# Altium schematic sheet CANDataDiodeSchematic-STM32F0-Rev7.SchDoc: CAN Data Diode STM32F0
size Legal; DrawnBy: Jeremy Daily; Revision: 1
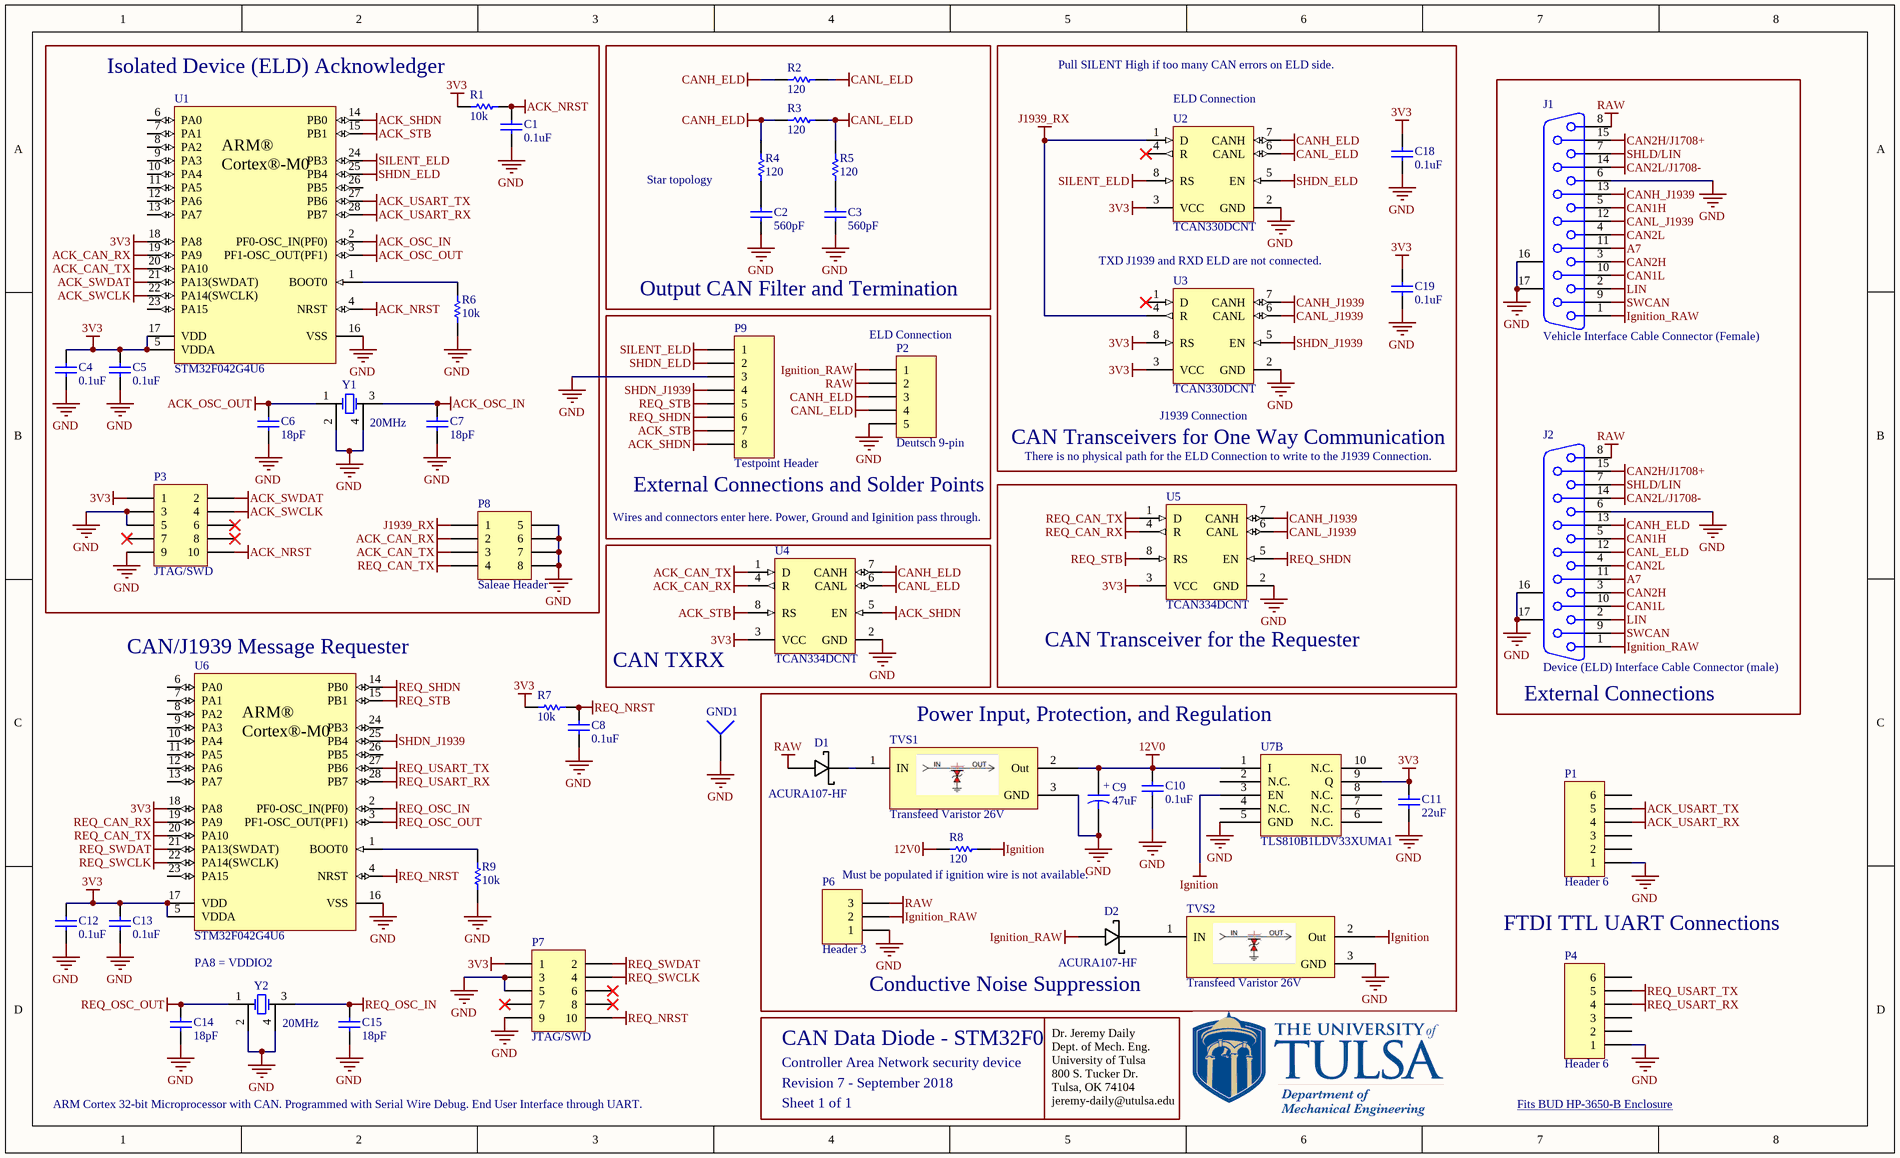
[diagram p0: CANDataDiodeSchematic-STM32F0-Rev7.SchDoc]

## Parts
C1  0.1uF  [0402]
C2  560pF  [0402]
C3  560pF  [0402]
C4  0.1uF  [0402]
C5  0.1uF  [0402]
C6  18pF  [0402]
C7  18pF  [0402]
C8  0.1uF  [0402]
C9  47uF  [Elec. Cap - D]
C10  0.1uF  [0402]
C11  22uF  [1206]
C12  0.1uF  [0402]
C13  0.1uF  [0402]
C14  18pF  [0402]
C15  18pF  [0402]
C18  0.1uF  [0402]
C19  0.1uF  [0402]
D1  ACURA107-HF  [SMA with A and K]
D2  ACURA107-HF  [SMA with A and K]
GND1  Socket  [PIN1]  (value not drawn)
J1  Vehicle Interface Cable Connector (Female)  [DSUB1.385-2H15]
J2  Device (ELD) Interface Cable Connector (male)  [DSUB1.385-2H15]
P1  Header 6  [HDR1X6]
P2  Deutsch 9-pin  [HDR1X5]
P3  JTAG/SWD  [MHDR2X5]
P4  Header 6  [HDR1X6]
P6  Header 3  [HDR1X3]
P7  JTAG/SWD  [MHDR2X5]
P8  Saleae Header  [HDR2X4_CEN]
P9  Testpoint Header  [HDR1X8]
R1  10k  [0402]
R2  120  [0402]
R3  120  [0402]
R4  120  [0402]
R5  120  [0402]
R6  10k  [0402]
R7  10k  [0402]
R8  120  [0402]
R9  10k  [0402]
TVS1  Transfeed Varistor 26V  [Transfeed]
TVS2  Transfeed Varistor 26V  [Transfeed]
U1  STM32F042G4U6  [STM-UFQFPN28_V]
U2  TCAN330DCNT  [SOT65P280X145-8N]
U3  TCAN330DCNT  [SOT65P280X145-8N]
U4  TCAN334DCNT  [SOT65P280X145-8N]
U5  TCAN334DCNT  [SOT65P280X145-8N]
U6  STM32F042G4U6  [STM-UFQFPN28_V]
U7  TLS810B1LDV33XUMA1  [SON50P330X110_HS-11N]  (part B of 2)
Y1  20MHz  [XTAL 4 pad]
Y2  20MHz  [XTAL 4 pad]

## Blocks framed on the sheet
Isolated Device (ELD) Acknowledger: C1 C4-C7 P3 P8 R1 R6 U1 Y1
Output CAN Filter and Termination: C2 C3 R2-R5
CAN Transceivers for One Way Communication: C18 C19 U2 U3
External Connections: J1 J2
CAN Transceiver for the Requester: U5
CAN TXRX: U4

## Nets
3V3: C4.2 C5.2 C11.2 C12.2 C13.2 C18.2 C19.2 P3.1 P7.1 R1.2 R7.2 U1.5(VDDA) U1.17(VDD) U1.18(PA8) U2.3(VCC) U3.3(VCC) U3.8(RS) U4.3(VCC) U5.3(VCC) U6.5(VDDA) U6.17(VDD) U6.18(PA8) U7.9(Q)
12V0: C9.1 C10.2 R8.1 TVS1.2(Out) U7.1(I)
A7: J1.11 J2.11
ACK_CAN_RX: P8.2 U1.19(PA9) U4.4(R)
ACK_CAN_TX: P8.3 U1.20(PA10) U4.1(D)
ACK_NRST: C1.2 P3.10 R1.1 U1.4(NRST)
ACK_OSC_IN: C7.1 U1.2(PF0-OSC_IN(PF0)) Y1.3(OSC2)
ACK_OSC_OUT: C6.2 U1.3(PF1-OSC_OUT(PF1)) Y1.1(OSC1)
ACK_SHDN: P9.8 U1.14(PB0) U4.5(EN)
ACK_STB: P9.7 U1.15(PB1) U4.8(RS)
ACK_SWCLK: P3.4 U1.22(PA14(SWCLK))
ACK_SWDAT: P3.2 U1.21(PA13(SWDAT))
ACK_USART_RX: P1.4 U1.28(PB7)
ACK_USART_TX: P1.5 U1.27(PB6)
CAN1H: J1.5 J2.5
CAN1L: J1.10 J2.10
CAN2H: J1.3 J2.3
CAN2H/J1708+: J1.15 J2.15
CAN2L: J1.4 J2.4
CAN2L/J1708-: J1.14 J2.14
CANH_ELD: J2.13 P2.3 R2.2 R3.2 R4.1 U2.7(CANH) U4.7(CANH)
CANH_J1939: J1.13 U3.7(CANH) U5.7(CANH)
CANL_ELD: J2.12 P2.4 R2.1 R3.1 R5.1 U2.6(CANL) U4.6(CANL)
CANL_J1939: J1.12 U3.6(CANL) U5.6(CANL)
GND: C1.1 C2.1 C3.1 C4.1 C5.1 C6.1 C7.2 C8.1 C9.2(-) C10.1 C11.1 C12.1 C13.1 C14.1 C15.2 C18.1 C19.1 GND1.1 J1.6 J1.16(MH1) J1.17(MH2) J2.6 J2.16(MH1) J2.17(MH2) P1.1 P2.5 P3.3 P3.5 P3.9 P4.1 P6.1 P7.3 P7.5 P7.9 P8.5 P8.6 P8.7 P8.8 P9.3 R6.1 R9.1 TVS1.3(GND) TVS2.3(GND) U1.16(VSS) U2.2(GND) U3.2(GND) U4.2(GND) U5.2(GND) U6.16(VSS) U7.5(GND) Y1.2(OSC2) Y1.4(GND) Y2.2(OSC2) Y2.4(GND)
Ignition: R8.2 TVS2.2(Out) U7.3(EN)
Ignition_RAW: D2.1(A) J1.1 J2.1 P2.1 P6.2
J1939_RX: P8.1 U2.1(D) U3.4(R)
LIN: J1.2 J2.2
RAW: D1.1(A) J1.8 J2.8 P2.2 P6.3
REQ_CAN_RX: U5.4(R) U6.19(PA9)
REQ_CAN_TX: P8.4 U5.1(D) U6.20(PA10)
REQ_NRST: C8.2 P7.10 R7.1 U6.4(NRST)
REQ_OSC_IN: C15.1 U6.2(PF0-OSC_IN(PF0)) Y2.3(OSC2)
REQ_OSC_OUT: C14.2 U6.3(PF1-OSC_OUT(PF1)) Y2.1(OSC1)
REQ_SHDN: P9.6 U5.5(EN) U6.14(PB0)
REQ_STB: P9.5 U5.8(RS) U6.15(PB1)
REQ_SWCLK: P7.4 U6.22(PA14(SWCLK))
REQ_SWDAT: P7.2 U6.21(PA13(SWDAT))
REQ_USART_RX: P4.4 U6.28(PB7)
REQ_USART_TX: P4.5 U6.27(PB6)
SHDN_ELD: P9.2 U1.25(PB4) U2.5(EN)
SHDN_J1939: P9.4 U3.5(EN) U6.25(PB4)
SHLD/LIN: J1.7 J2.7
SILENT_ELD: P9.1 U1.24(PB3) U2.8(RS)
SWCAN: J1.9 J2.9
NetC2_2: C2.2 R4.2
NetC3_2: C3.2 R5.2
NetD1_2: D1.2(K) TVS1.1(IN)
NetD2_2: D2.2(K) TVS2.1(IN)
NetR6_2: R6.2 U1.1(BOOT0)
NetR9_2: R9.2 U6.1(BOOT0)

Not connected (* = marked no-connect by the designer): P1 2 3 6; P3 6* 7* 8*; P4 2 3 6; P7 6* 7* 8*; U1 6(PA0) 7(PA1) 8(PA2) 9(PA3) 10(PA4) 11(PA5) 12(PA6) 13(PA7) 23(PA15) 26(PB5); U2 4(R)*; U3 1(D)*; U6 6(PA0) 7(PA1) 8(PA2) 9(PA3) 10(PA4) 11(PA5) 12(PA6) 13(PA7) 23(PA15) 24(PB3) 26(PB5); U7 2(N.C.) 4(N.C.) 6(N.C.) 7(N.C.) 8(N.C.) 10(N.C.)

## Notes on the sheet
- Pull SILENT High if too many CAN errors on ELD side.
- (near U2) ELD Connection
- (near U1) ARM®
  Cortex®-M0
- Star topology
- TXD J1939 and RXD ELD are not connected.
- (near P2) ELD Connection
- (near U3) J1939 Connection
- (near P9) External Connections and Solder Points
- (near J2) There is no physical path for the ELD Connection to write to the J1939 Connection.
- Wires and connectors enter here. Power, Ground and Iginition pass through.
- (near U6) CAN/J1939 Message Requester
- (near U6) ARM®
  Cortex®-M0
- Power Input, Protection, and Regulation
- Must be populated if ignition wire is not available.
- PA8 = VDDIO2
- FTDI TTL UART Connections
- CAN Data Diode - STM32F0
- (near TVS2) Conductive Noise Suppression
- ARM Cortex 32-bit Microprocessor with CAN. Programmed with Serial Wire Debug. End User Interface through UART.
- Controller Area Network security device
- Revision 7 - September 2018
- Sheet 1 of 1
- Fits BUD HP-3650-B Enclosure <https://www.budind.com/pdf/hb3650.pdf>
- Dr. Jeremy Daily
  Dept. of Mech. Eng.
  University of Tulsa
  800 S. Tucker Dr.
  Tulsa, OK 74104
  jeremy-daily@utulsa.edu
- (in symbol Electrolytic Cap) +

## Library data of the parts
C1 C4 C5 C8 C10 C12 C13 C18 C19 = Cap: 0.1µF ±10% 50V Ceramic Capacitor X7R 0402 (1005 Metric); Manufacturer: TDK Corporation; PartNumber: CGA2B3X7R1H104K050BB; Alternative: Acceptable; Supplier 1: Digi-Key; Supplier Part Number 1: 445-6899-1-ND
C2 C3 = Cap: 560pF ±5% 50V Ceramic Capacitor CH 0402 (1005 Metric); Manufacturer: Taiyo Yuden; PartNumber: 06031C561K4T2A; Alternative: Acceptable; Supplier 1: Digi-Key; Supplier Part Number 1: 587-5093-1-ND
C6 C7 C14 C15 = Cap: 18pF ±5% 50V Ceramic Capacitor C0G, NP0 0402 (1005 Metric); Manufacturer: Murata Electronics North America; PartNumber: GCM1555C1H180JA16D; Alternative: Acceptable; Supplier 1: Digi-Key; Supplier Part Number 1: 490-12650-1-ND
C9 = Electrolytic Cap: 47µF 35V Aluminum Capacitors Radial, Can - SMD 5000 Hrs @ 105°C; Manufacturer: Panasonic Electronic Components; PartNumber: EEE-HDV470XAP; Alternative: Acceptable; Supplier 1: Digi-Key; Supplier Part Number 1: PCE4968CT-ND
C11 = Cap: 22µF ±20% 4V Ceramic Capacitor X7R 1206 (3216 Metric); Manufacturer: Taiyo Yuden; PartNumber: AMK316AB7226MLHT; Alternative: Acceptable; Supplier 1: Digi-Key; Supplier Part Number 1: 587-3267-1-ND
D1 D2 = Schottky Diode: Diode Schottky 1000V 1A Surface Mount DO-214AC (SMA); Manufacturer: Comchip Technology; Alternative: None; Supplier 1: Digi-Key; Supplier Part Number 1: 641-1884-1-ND; PartNumber: ACURA107-HF
GND1 = Socket: Alternative: None
J1 = D Connector 15: Receptacle Assembly, 15 Position, Right Angle; Manufacturer: Amphenol FCI; PartNumber: D15S33E4GV00LF; Alternative: Acceptable; Supplier 1: Digi-Key; Supplier Part Number 1: 609-1498-ND
J2 = D Connector 15: Receptacle Assembly, 15 Position, Right Angle; Manufacturer: Amphenol FCI; PartNumber: D15P33E4GV00LF; Alternative: None; Supplier 1: Digi-Key; Supplier Part Number 1: 609-1492-ND
P1 P4 = Header 6: Header, 6-Pin; Manufacturer: Sullins Connector Solutions; PartNumber: PBC06SFAN; Alternative: None; Supplier 1: Digi-Key; Supplier Part Number 1: S1211E-06-ND
P2 = Header 5: Pins A,B C, D oin the J1939 connector; Alternative: None
P3 = MHDR2X5: Connector Header Through Hole 10 position 0.050" (1.27mm); Manufacturer: CNC Tech; PartNumber: 1175-1627-ND; Alternative: Acceptable; Supplier 1: Digi-Key; Supplier Part Number 1: 1175-1627-ND
P6 = Header 3: Header, 3-Pin; Alternative: None
P7 = MHDR2X5: Header, 5-Pin, Dual row; Manufacturer: CNC Tech; PartNumber: 1175-1627-ND; Alternative: Acceptable; Supplier 1: Digi-Key; Supplier Part Number 1: 1175-1627-ND
P8 = Header 4X2A: Header, 4-Pin, Dual row; Alternative: None
P9 = Header 8: Header, 8-Pin; Alternative: None
R1 R6 R7 R9 = Chip Resistor: 10 kOhms ±0.5% 0.063W, 1/16W Chip Resistor 0402 (1005 Metric) Anti-Sulfur, Automotive AEC-Q200 Thin Film; Manufacturer: Susumu; PartNumber: RG1005P-103-D-T10; Alternative: Acceptable; Supplier 1: Digi-Key; Supplier Part Number 1: RG10P10.0KDCT-ND
R2-R5 R8 = Chip Resistor: 120 Ohms ±1% 0.063W, 1/16W Chip Resistor 0402 (1005 Metric) Automotive AEC-Q200 Thick Film; Manufacturer: Vishay Dale; PartNumber: CRCW0402120RFKED; Alternative: Acceptable; Supplier 1: Digi-Key; Supplier Part Number 1: 541-120LCT-ND
TVS1 TVS2 = Transfeed: 34.5V 80A Varistor 1 Circuit Surface Mount 0805 (2012 Metric); Manufacturer: AVX; PartNumber: V2AF126C600Y2EDP; Alternative: None; Supplier 1: Digi-Key; Supplier Part Number 1: 478-10038-1-ND
U1 U6 = STM32F050G4U6: ARM® Cortex®-M0 STM32F0 Microcontroller IC 32-Bit 48MHz 16KB (16K x 8) FLASH 28-UFQFPN (4x4); Manufacturer: STMicroelectronics; Alternative: None; Supplier 1: Digi-Key; Supplier Part Number 1: 497-17830-ND; PartNumber: STM32F042G4U6
U2-U5 = SN65HVD234DR: IC TXRX CAN 3.3V SOT23-8; Manufacturer: Texas Instruments; Alternative: None; Supplier 1: Digi-Key; Footprint: PCA82C250, excludes pin5
  U2 U3: Supplier Part Number 1: 296-44210-1-ND; PartNumber: TCAN330DCNT
  U4 U5: Supplier Part Number 1: 296-44503-1-ND; PartNumber: TCAN334DCNT
U7 = TLS810B1: Linear Voltage Regulator IC  1 Output  100mA PG-TSON-10; Manufacturer: Infineon Technologies; Alternative: None; Supplier 1: Digi-Key; PartNumber: TLS810B1LDV33XUMA1; Supplier Part Number 1: TLS810B1LDV33XUMA1CT-ND
Y1 Y2 = Crystal with Ground: 20MHz ±30ppm Crystal 18pF 60 Ohms 4-SMD, No Lead; Manufacturer: ECS Inc.; PartNumber: ECS-200-18-33Q-DS; Alternative: None; Supplier 1: Digi-Key; Supplier Part Number 1: XC1998CT-ND